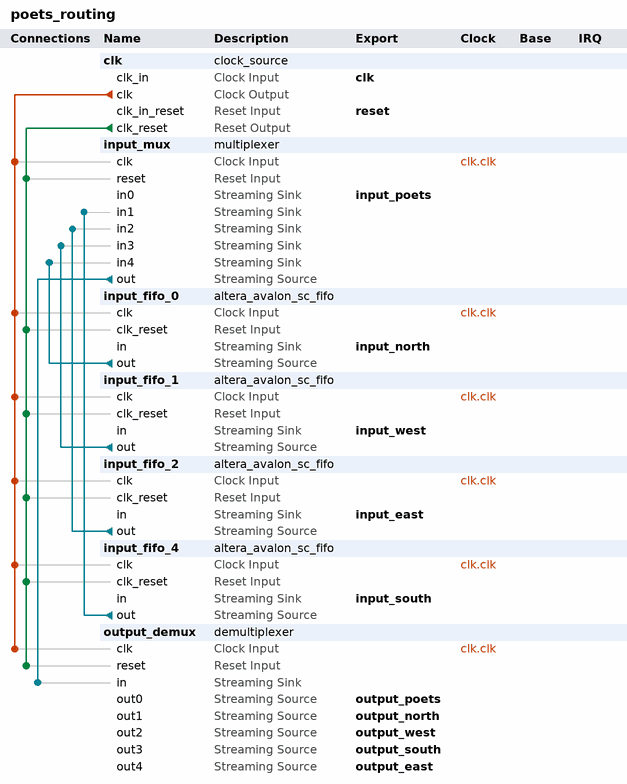
[diagram p0: system contents]
# Platform Designer (Qsys) system poets_routing, Cyclone V 5CSEMA5F31C6
# Parameters at their usual value, and those the tool derives, are not listed.
package require -exact qsys 16.1
create_system poets_routing
set_project_property DEVICE_FAMILY {Cyclone V}
set_project_property DEVICE 5CSEMA5F31C6

add_instance clk clock_source 16.1
set_instance_parameter_value clk clockFrequency 50000000

add_instance input_mux multiplexer 16.1
set_instance_parameter_value input_mux bitsPerSymbol 8
set_instance_parameter_value input_mux errorWidth 0
set_instance_parameter_value input_mux numInputInterfaces 5
set_instance_parameter_value input_mux outChannelWidth 3
set_instance_parameter_value input_mux packetScheduling true
set_instance_parameter_value input_mux schedulingSize 2
set_instance_parameter_value input_mux symbolsPerBeat 4
set_instance_parameter_value input_mux useHighBitsOfChannel true
set_instance_parameter_value input_mux usePackets true

add_instance input_fifo_0 altera_avalon_sc_fifo 16.1
set_instance_parameter_value input_fifo_0 BITS_PER_SYMBOL 8
set_instance_parameter_value input_fifo_0 CHANNEL_WIDTH 0
set_instance_parameter_value input_fifo_0 ERROR_WIDTH 0
set_instance_parameter_value input_fifo_0 FIFO_DEPTH 16
set_instance_parameter_value input_fifo_0 SYMBOLS_PER_BEAT 4
set_instance_parameter_value input_fifo_0 USE_FILL_LEVEL 0
set_instance_parameter_value input_fifo_0 USE_MEMORY_BLOCKS 1
set_instance_parameter_value input_fifo_0 USE_PACKETS 1
set_instance_parameter_value input_fifo_0 USE_STORE_FORWARD 0

add_instance input_fifo_1 altera_avalon_sc_fifo 16.1
set_instance_parameter_value input_fifo_1 BITS_PER_SYMBOL 8
set_instance_parameter_value input_fifo_1 CHANNEL_WIDTH 0
set_instance_parameter_value input_fifo_1 ERROR_WIDTH 0
set_instance_parameter_value input_fifo_1 FIFO_DEPTH 16
set_instance_parameter_value input_fifo_1 SYMBOLS_PER_BEAT 4
set_instance_parameter_value input_fifo_1 USE_FILL_LEVEL 0
set_instance_parameter_value input_fifo_1 USE_MEMORY_BLOCKS 1
set_instance_parameter_value input_fifo_1 USE_PACKETS 1
set_instance_parameter_value input_fifo_1 USE_STORE_FORWARD 0

add_instance input_fifo_2 altera_avalon_sc_fifo 16.1
set_instance_parameter_value input_fifo_2 BITS_PER_SYMBOL 8
set_instance_parameter_value input_fifo_2 CHANNEL_WIDTH 0
set_instance_parameter_value input_fifo_2 ERROR_WIDTH 0
set_instance_parameter_value input_fifo_2 FIFO_DEPTH 16
set_instance_parameter_value input_fifo_2 SYMBOLS_PER_BEAT 4
set_instance_parameter_value input_fifo_2 USE_FILL_LEVEL 0
set_instance_parameter_value input_fifo_2 USE_MEMORY_BLOCKS 1
set_instance_parameter_value input_fifo_2 USE_PACKETS 1
set_instance_parameter_value input_fifo_2 USE_STORE_FORWARD 0

add_instance input_fifo_4 altera_avalon_sc_fifo 16.1
set_instance_parameter_value input_fifo_4 BITS_PER_SYMBOL 8
set_instance_parameter_value input_fifo_4 CHANNEL_WIDTH 0
set_instance_parameter_value input_fifo_4 ERROR_WIDTH 0
set_instance_parameter_value input_fifo_4 FIFO_DEPTH 16
set_instance_parameter_value input_fifo_4 SYMBOLS_PER_BEAT 4
set_instance_parameter_value input_fifo_4 USE_FILL_LEVEL 0
set_instance_parameter_value input_fifo_4 USE_MEMORY_BLOCKS 1
set_instance_parameter_value input_fifo_4 USE_PACKETS 1
set_instance_parameter_value input_fifo_4 USE_STORE_FORWARD 0

add_instance output_demux demultiplexer 16.1
set_instance_parameter_value output_demux bitsPerSymbol 8
set_instance_parameter_value output_demux errorWidth 0
set_instance_parameter_value output_demux inChannelWidth 3
set_instance_parameter_value output_demux numOutputInterfaces 5
set_instance_parameter_value output_demux symbolsPerBeat 4
set_instance_parameter_value output_demux useHighBitsOfChannel true
set_instance_parameter_value output_demux usePackets true

# connections
add_connection clk.clk input_fifo_0.clk clock
add_connection clk.clk input_fifo_1.clk clock
add_connection clk.clk input_fifo_2.clk clock
add_connection clk.clk input_fifo_4.clk clock
add_connection clk.clk input_mux.clk clock
add_connection clk.clk output_demux.clk clock
add_connection clk.clk_reset input_fifo_0.clk_reset reset
add_connection clk.clk_reset input_fifo_1.clk_reset reset
add_connection clk.clk_reset input_fifo_2.clk_reset reset
add_connection clk.clk_reset input_fifo_4.clk_reset reset
add_connection clk.clk_reset input_mux.reset reset
add_connection clk.clk_reset output_demux.reset reset
add_connection input_fifo_0.out input_mux.in4 avalon_streaming
add_connection input_fifo_1.out input_mux.in3 avalon_streaming
add_connection input_fifo_2.out input_mux.in2 avalon_streaming
add_connection input_fifo_4.out input_mux.in1 avalon_streaming
add_connection input_mux.out output_demux.in avalon_streaming

# exported interfaces
add_interface clk clock sink
set_interface_property clk EXPORT_OF clk.clk_in
add_interface input_east avalon_streaming sink
set_interface_property input_east EXPORT_OF input_fifo_2.in
add_interface input_north avalon_streaming sink
set_interface_property input_north EXPORT_OF input_fifo_0.in
add_interface input_poets avalon_streaming sink
set_interface_property input_poets EXPORT_OF input_mux.in0
add_interface input_south avalon_streaming sink
set_interface_property input_south EXPORT_OF input_fifo_4.in
add_interface input_west avalon_streaming sink
set_interface_property input_west EXPORT_OF input_fifo_1.in
add_interface output_east avalon_streaming source
set_interface_property output_east EXPORT_OF output_demux.out4
add_interface output_north avalon_streaming source
set_interface_property output_north EXPORT_OF output_demux.out1
add_interface output_poets avalon_streaming source
set_interface_property output_poets EXPORT_OF output_demux.out0
add_interface output_south avalon_streaming source
set_interface_property output_south EXPORT_OF output_demux.out3
add_interface output_west avalon_streaming source
set_interface_property output_west EXPORT_OF output_demux.out2
add_interface reset reset sink
set_interface_property reset EXPORT_OF clk.clk_in_reset

set_interconnect_requirement {$system} qsys_mm.clockCrossingAdapter HANDSHAKE
set_interconnect_requirement {$system} qsys_mm.enableEccProtection FALSE
set_interconnect_requirement {$system} qsys_mm.insertDefaultSlave FALSE
set_interconnect_requirement {$system} qsys_mm.maxAdditionalLatency 1

save_system poets_routing.qsys
